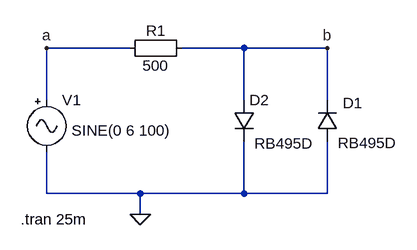
[diagram p0: schematic LD-B3.asc]
LD-B3.asc, the LTspice schematic file:
Version 4
SHEET 1 880 680
WIRE 32 144 -96 144
WIRE 208 144 112 144
WIRE 336 144 208 144
WIRE -96 224 -96 144
WIRE 208 224 208 144
WIRE 336 224 336 144
WIRE -96 368 -96 304
WIRE 48 368 -96 368
WIRE 208 368 208 288
WIRE 208 368 48 368
WIRE 336 368 336 288
WIRE 336 368 208 368
WIRE 48 400 48 368
FLAG -96 144 a
FLAG 336 144 b
FLAG 48 400 0
SYMBOL diode 352 288 R180
WINDOW 0 -39 59 Left 2
WINDOW 3 -91 -2 Left 2
SYMATTR InstName D1
SYMATTR Value RB495D
SYMBOL Misc\\signal -96 208 R0
WINDOW 123 0 0 Left 2
WINDOW 39 0 0 Left 2
WINDOW 3 38 63 Left 2
SYMATTR Value SINE(0 6 100)
SYMATTR InstName V1
SYMBOL Misc\\EuropeanResistor 128 128 R90
WINDOW 0 5 56 VBottom 2
WINDOW 3 27 56 VTop 2
SYMATTR InstName R1
SYMATTR Value 500
SYMBOL diode 192 224 R0
WINDOW 3 32 67 Left 2
SYMATTR InstName D2
SYMATTR Value RB495D
TEXT -136 408 Left 2 !.tran 25m

The netlist it stands for:
* LD-B3.asc
D1 0 b RB495D
V1 a 0 SINE(0 6 100)
R1 b a 500
D2 b 0 RB495D
.model D D
.lib standard.dio
.tran 25m
.backanno
.end